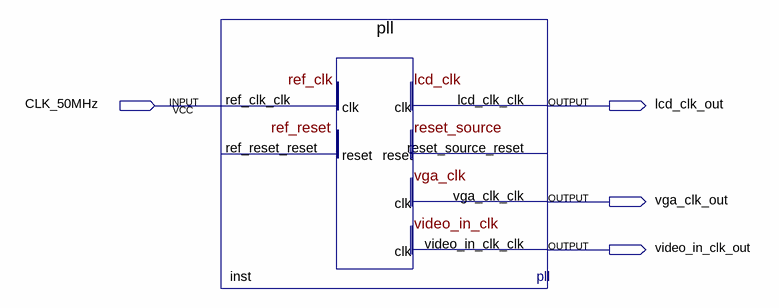
[diagram p0: schematic sheet]
// Quartus schematic video_in.bdf as structural Verilog: 1 symbols, 4 pins
module video_in (
  input  CLK_50MHz,
  output lcd_clk_out,
  output vga_clk_out,
  output video_in_clk_out
);

  pll inst (
    .ref_clk_clk(CLK_50MHz), .lcd_clk_clk(lcd_clk_out), .vga_clk_clk(vga_clk_out),
    .video_in_clk_clk(video_in_clk_out));  // open: ref_reset_reset, reset_source_reset
endmodule
